# EAGLE schematic Aerator slave (EAGLE 8.6.0)
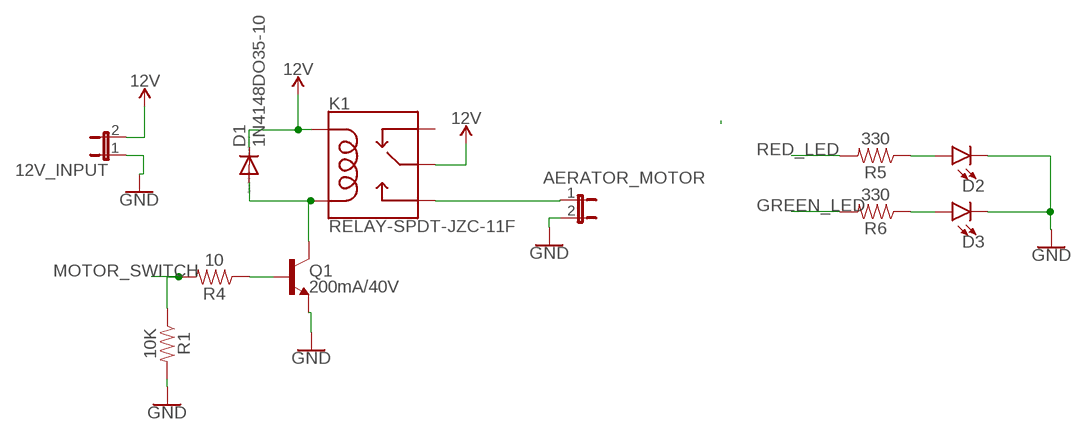
[diagram p0: schematic, sheet 1]

## Parts
12V_INPUT  JUMPER-2PTH  [1X02]
AERATOR_MOTOR  JUMPER-2PTH  [1X02]
D1  1N4148DO35-10  [DO35-10]
D2  LED5MM  [LED_5MM]
D3  LED5MM  [LED_5MM]
K1  RELAY-SPDT-JZC-11F  [RELAY-JZC]
Q1  200mA/40V  TRANS_NPN-2N3904  [TO-92]
R1  10K  10OHM-HORIZ-1/4W-1%  [AXIAL-0.3]
R4  10  10OHM-HORIZ-1/4W-1%  [AXIAL-0.3]
R5  330  330OHM-HORIZ-1/10W-5%  [AXIAL-0.3]
R6  330  330OHM-HORIZ-1/10W-5%  [AXIAL-0.3]

## Nets
GND: 12V_INPUT.1 AERATOR_MOTOR.2 D2.K(C) D3.K(C) Q1.1(E) R1.P$2
GREEN_LED: R6.P$2
MOTOR_SWITCH: R1.P$1 R4.P$2
N$6: D1.A K1.1(COIL2) Q1.3(C)
N$7: AERATOR_MOTOR.1 K1.3(NO)
N$8: Q1.2(B) R4.P$1
N$10: D2.A R5.P$1
N$11: D3.A R6.P$1
RED_LED: R5.P$2
VCC_1: 12V_INPUT.2 D1.C K1.4(MAIN) K1.5(COIL1) ; supply symbol labelled 12V
Unconnected: K1.2(NC)

## Library data of the parts
12V_INPUT AERATOR_MOTOR = SparkFun-Retired:JUMPER-2: Jumper Basic 0.1" spaced jumper. Use with breakaway headers.
D1 = diode:1N4148: DIODE high speed (Philips)
D2 D3 = SparkFun-LED:LED: LED (Generic) Standard schematic elements and footprints for 5mm, 3mm, 1206, and 0603 sized LEDs. Generic LEDs with no color specified.
K1 = SparkFun-Electromechanical:RELAY-SPDT: SPDT Electromechanical Relay Single-pole, double-throw sealed relays. When current is applied to the coil, it throws a simple changeover switch, terminating the connection from the NC contact to ground and closing the NO contact. Use them to switch high voltage/high current devices. SparkFun Products JQX-15F: Relay SPDT Sealed - 20A <https://www.sparkfun.com/products/10924> (COM-10924) JZC-11F: Relay SPDT Sealed <https://www.sparkfun.com/products/100> (COM-00100); PROD_ID: COMP-09533; SF_SKU: COM-00100
Q1 = SparkFun-DiscreteSemi:TRANS_NPN: NPN transistor Current controlled devices typically used to amplify current or used as a switch. BC547 - COM-08928 <http://www.sparkfun.com/products/8928> (TO-92 45V 100mA) (1.Collector 2.Base 3.Emitter) 2N3904 - COM-00521 <http://www.sparkfun.com/products/521> (TO-92 40V 200mA) (1.Emitter 2.Base 3.Collector) P2N2222A - COM-12852 <http://www.sparkfun.com/products/12852> (TO-92 40V 600mA) (1.Collector 2.Base 3.Emitter); PROD_ID: TRANS-08447
R1 = SparkFun-Resistors:10OHM: 10Ω resistor A resistor is a passive two-terminal electrical component that implements electrical resistance as a circuit element. Resistors act to reduce current flow, and, at the same time, act to lower voltage levels within circuits. - Wikipedia; PROD_ID: RES-12180; VALUE: 10
R4 = SparkFun-Resistors:10OHM: 10Ω resistor A resistor is a passive two-terminal electrical component that implements electrical resistance as a circuit element. Resistors act to reduce current flow, and, at the same time, act to lower voltage levels within circuits. - Wikipedia; PROD_ID: RES-12180
R5 R6 = SparkFun-Resistors:330OHM: 330Ω resistor A resistor is a passive two-terminal electrical component that implements electrical resistance as a circuit element. Resistors act to reduce current flow, and, at the same time, act to lower voltage levels within circuits. - Wikipedia; PROD_ID: RES-8371